# EAGLE design umodular_mega_shield_rev02 (EAGLE 7.2.0)
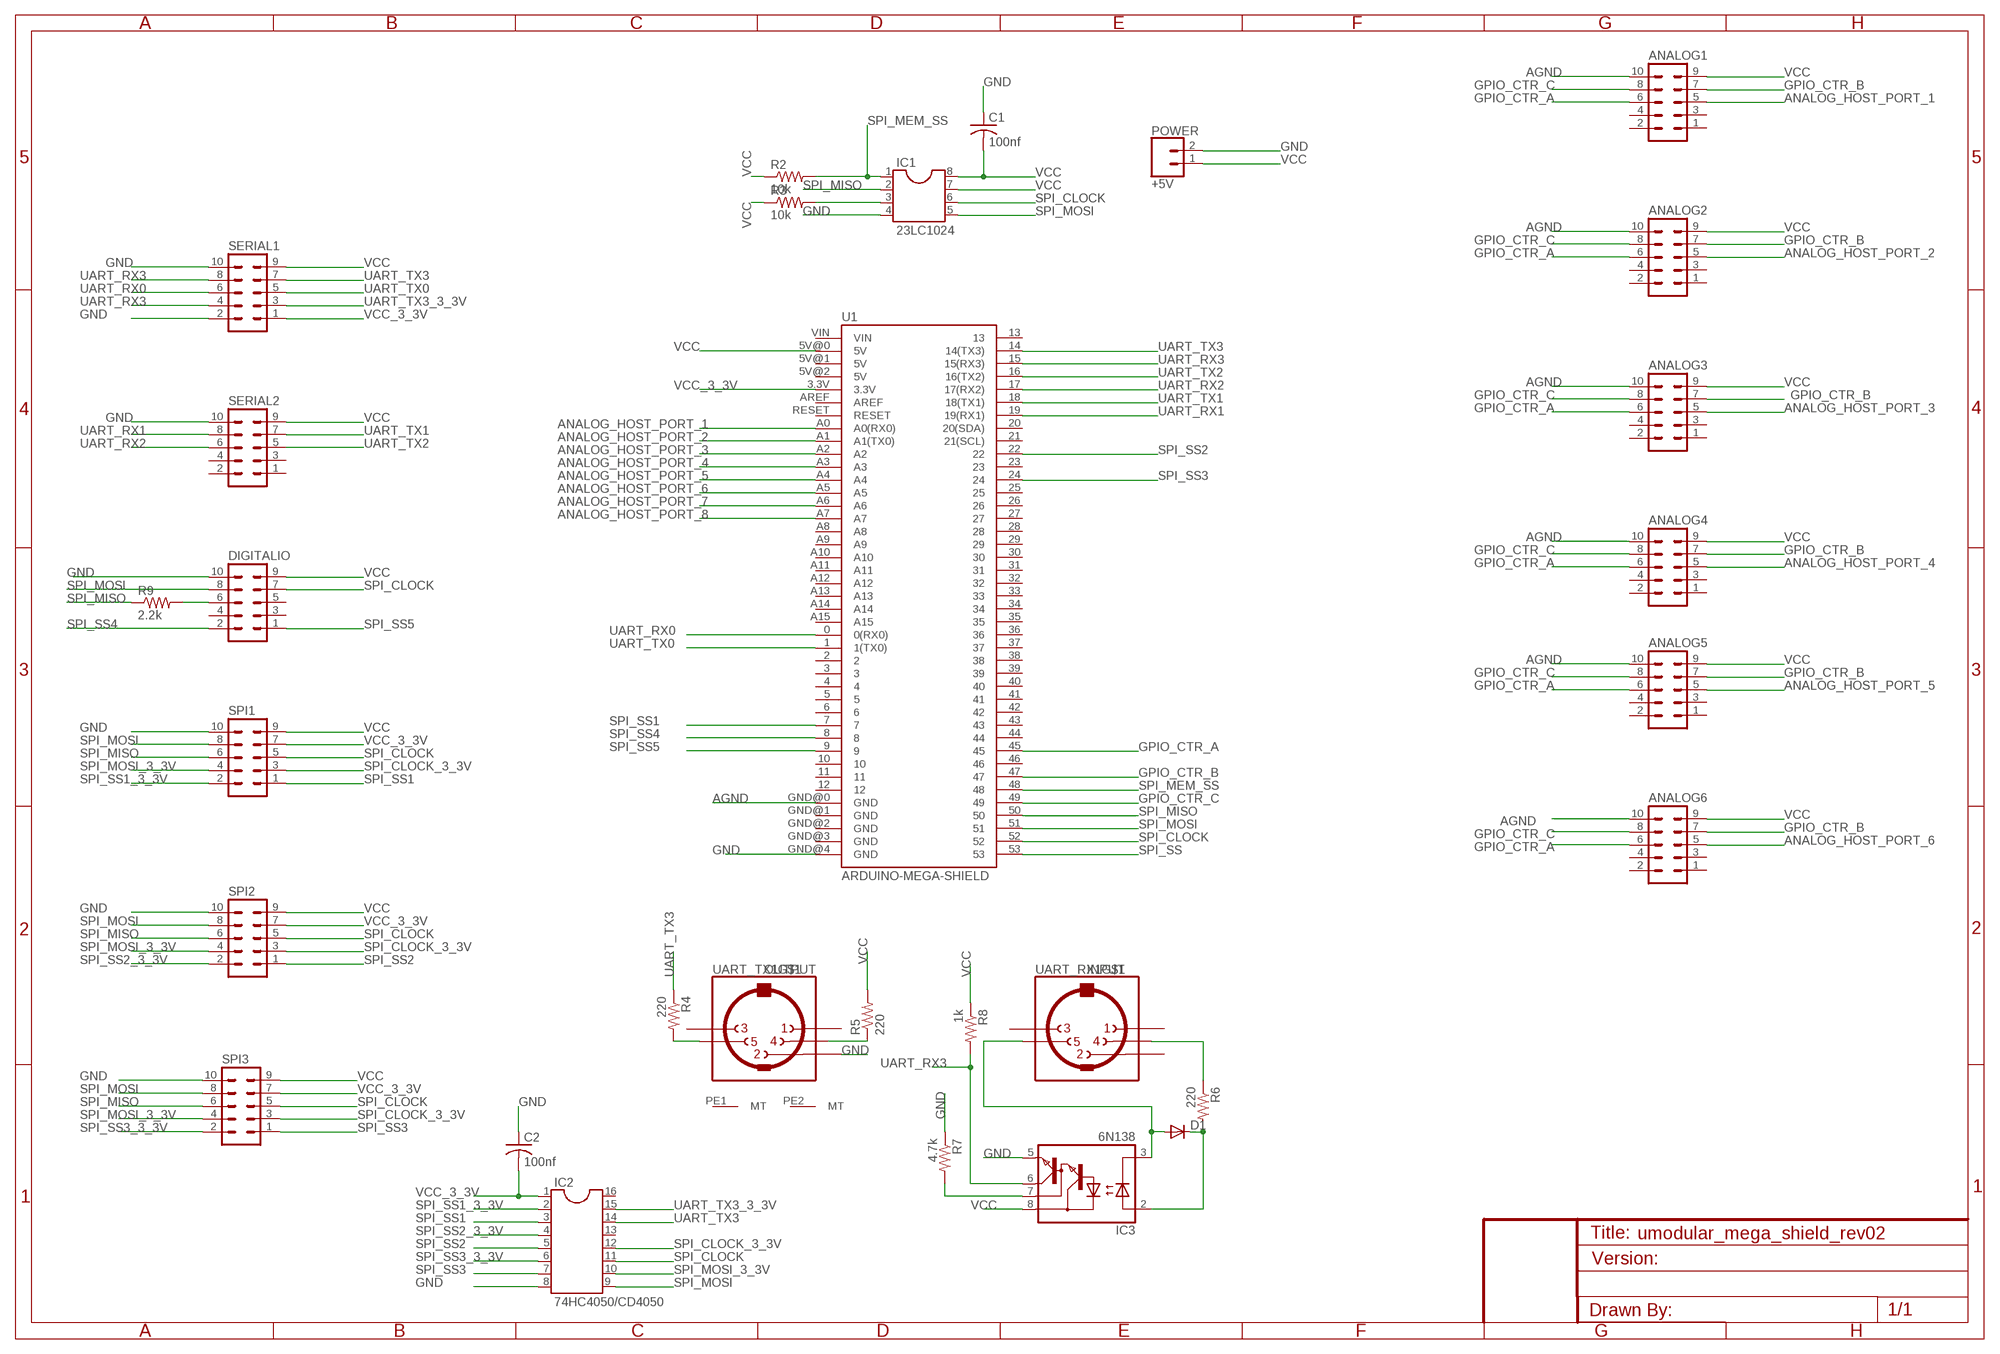
[diagram p0: schematic, sheet 1]

## Parts
ANALOG1  MA05-2  [MA05-2]
ANALOG2  MA05-2  [MA05-2]
ANALOG3  MA05-2  [MA05-2]
ANALOG4  MA05-2  [MA05-2]
ANALOG5  MA05-2  [MA05-2]
ANALOG6  MA05-2  [MA05-2]
C1  100nf  C-US050-024X044  [C050-024X044]
C2  100nf  C-US050-024X044  [C050-024X044]
D1  1N4148DO35-7  [DO35-7]
DIGITALIO  MA05-2  [MA05-2]
IC1  23LC1024  DIL8  [DIL08]
IC2  74HC4050/CD4050  DIL16  [DIL16]
IC3  6N138  [DIL08]
POWER  +5V  CONN_02LOCK_LONGPADS  [1X02_LOCK_LONGPADS]
R2  10k  R-US_0204/7  [0204/7@1]
R3  10k  R-US_0204/7  [0204/7@1]
R4  220  R-US_0204/7  [0204/7@1]
R5  220  R-US_0204/7  [0204/7@1]
R6  220  R-US_0204/7  [0204/7@1]
R7  4.7k  R-US_0204/7  [0204/7@1]
R8  1k  R-US_0204/7  [0204/7@1]
R9  2.2k  R-US_0204/7  [0204/7@1]
SERIAL1  MA05-2  [MA05-2]
SERIAL2  MA05-2  [MA05-2]
SPI1  MA05-2  [MA05-2]
SPI2  MA05-2  [MA05-2]
SPI3  MA05-2  [MA05-2]
U1  ARDUINO-MEGA-SHIELD  ARDUINO-MEGAFULL  [ARDUINO_MEGA@1]
UART_RX1  INPUT  MIDIJACK  [CP-2350]
UART_TX1  OUTPUT  MIDIJACK  [CP-2350]

## Nets
AGND: ANALOG1.10 ANALOG2.10 ANALOG3.10 ANALOG4.10 ANALOG5.10 ANALOG6.10 U1.GND@0(GND)
ANALOG_HOST_PORT_1: ANALOG1.5 U1.A0(A0(RX0))
ANALOG_HOST_PORT_2: ANALOG2.5 U1.A1(A1(TX0))
ANALOG_HOST_PORT_3: ANALOG3.5 U1.A2
ANALOG_HOST_PORT_4: ANALOG4.5 U1.A3
ANALOG_HOST_PORT_5: ANALOG5.5 U1.A4
ANALOG_HOST_PORT_6: ANALOG6.5 U1.A5
ANALOG_HOST_PORT_7: U1.A6
ANALOG_HOST_PORT_8: U1.A7
GND: C1.1 C2.1 DIGITALIO.10 IC1.4 IC2.8 IC3.5(GND) POWER.2 R7.1 SERIAL1.2 SERIAL1.10 SERIAL2.10 SPI1.10 SPI2.10 SPI3.10 U1.GND@4(GND) UART_TX1.2
GPIO_CTR_A: ANALOG1.6 ANALOG2.6 ANALOG3.6 ANALOG4.6 ANALOG5.6 ANALOG6.6 U1.45
GPIO_CTR_B: ANALOG1.7 ANALOG2.7 ANALOG3.7 ANALOG4.7 ANALOG5.7 ANALOG6.7 U1.47
GPIO_CTR_C: ANALOG1.8 ANALOG2.8 ANALOG3.8 ANALOG4.8 ANALOG5.8 ANALOG6.8 U1.49
N$2: R5.1 UART_TX1.4
N$3: R4.2 UART_TX1.5
N$4: IC1.3 R3.2
N$5: R6.1 UART_RX1.4
N$6: D1.C IC3.2(A) R6.2
N$7: D1.A IC3.3(C) UART_RX1.5
N$8: IC3.7(VB) R7.2
N$9: DIGITALIO.6 R9.2
SPI_CLOCK: DIGITALIO.7 IC1.6 IC2.11 SPI1.5 SPI2.5 SPI3.5 U1.52
SPI_CLOCK_3_3V: IC2.12 SPI1.3 SPI2.3 SPI3.3
SPI_MEM_SS: IC1.1 R2.2 U1.48
SPI_MISO: IC1.2 R9.1 SPI1.6 SPI2.6 SPI3.6 U1.50
SPI_MOSI: DIGITALIO.8 IC1.5 IC2.9 SPI1.8 SPI2.8 SPI3.8 U1.51
SPI_MOSI_3_3V: IC2.10 SPI1.4 SPI2.4 SPI3.4
SPI_SS: U1.53
SPI_SS1: IC2.3 SPI1.1 U1.7
SPI_SS1_3_3V: IC2.2 SPI1.2
SPI_SS2: IC2.5 SPI2.1 U1.22
SPI_SS2_3_3V: IC2.4 SPI2.2
SPI_SS3: IC2.7 SPI3.1 U1.24
SPI_SS3_3_3V: IC2.6 SPI3.2
SPI_SS4: DIGITALIO.2 U1.8
SPI_SS5: DIGITALIO.1 U1.9
UART_RX0: SERIAL1.6 U1.0(0(RX0))
UART_RX1: SERIAL2.8 U1.19(19(RX1))
UART_RX2: SERIAL2.6 U1.17(17(RX2))
UART_RX3: IC3.6(VO) R8.2 SERIAL1.4 SERIAL1.8 U1.15(15(RX3))
UART_TX0: SERIAL1.5 U1.1(1(TX0))
UART_TX1: SERIAL2.7 U1.18(18(TX1))
UART_TX2: SERIAL2.5 U1.16(16(TX2))
UART_TX3: IC2.14 R4.1 SERIAL1.7 U1.14(14(TX3))
UART_TX3_3_3V: IC2.15 SERIAL1.3
VCC: ANALOG1.9 ANALOG2.9 ANALOG3.9 ANALOG4.9 ANALOG5.9 ANALOG6.9 C1.2 DIGITALIO.9 IC1.7 IC1.8 IC3.8(VCC) POWER.1 R2.1 R3.1 R5.2 R8.1 SERIAL1.9 SERIAL2.9 SPI1.9 SPI2.9 SPI3.9 U1.5V@0(5V)
VCC_3_3V: C2.2 IC2.1 SERIAL1.1 SPI1.7 SPI2.7 SPI3.7 U1.3.3V
Unconnected: ANALOG1.1 ANALOG1.2 ANALOG1.3 ANALOG1.4 ANALOG2.1 ANALOG2.2 ANALOG2.3 ANALOG2.4 ANALOG3.1 ANALOG3.2 ANALOG3.3 ANALOG3.4 ANALOG4.1 ANALOG4.2 ANALOG4.3 ANALOG4.4 ANALOG5.1 ANALOG5.2 ANALOG5.3 ANALOG5.4 ANALOG6.1 ANALOG6.2 ANALOG6.3 ANALOG6.4 DIGITALIO.3 DIGITALIO.4 DIGITALIO.5 IC2.13 IC2.16 SERIAL2.1 SERIAL2.2 SERIAL2.3 SERIAL2.4 U1.2 U1.3 U1.4 U1.5 U1.5V@1(5V) U1.5V@2(5V) U1.6 U1.10 U1.11 U1.12 U1.13 U1.20(20(SDA)) U1.21(21(SCL)) U1.23 U1.25 U1.26 U1.27 U1.28 U1.29 U1.30 U1.31 U1.32 U1.33 U1.34 U1.35 U1.36 U1.37 U1.38 U1.39 U1.40 U1.41 U1.42 U1.43 U1.44 U1.46 U1.A8 U1.A9 U1.A10 U1.A11 U1.A12 U1.A13 U1.A14 U1.A15 U1.AREF U1.GND@1(GND) U1.GND@2(GND) U1.GND@3(GND) U1.RESET U1.VIN UART_RX1.1 UART_RX1.2 UART_RX1.3 UART_RX1.PE1(MT) UART_RX1.PE2(MT) UART_RX1.PE(MT) UART_RX1.PE@(MT) UART_TX1.1 UART_TX1.3 UART_TX1.PE1(MT) UART_TX1.PE2(MT) UART_TX1.PE(MT) UART_TX1.PE@(MT)

## Library data of the parts
ANALOG1-ANALOG6 DIGITALIO SERIAL1 SERIAL2 SPI1-SPI3 = con-lstb:MA05-2: PIN HEADER; OC_FARNELL: unknown; OC_NEWARK: unknown
C1 C2 = rcl:C-US: CAPACITOR, American symbol
D1 = diode:1N4148: DIODE high speed (Philips)
IC1 = ic-package:DIL8: Dual In Line / Socket
IC2 = ic-package:DIL16: Dual In Line / Socket
IC3 = optocoupler:6N138: MOTOROLA OPTO COUPLER; MF: VISHAY/TELEFUNKEN; MPN: 6N138; OC_FARNELL: 9860150; OC_NEWARK: 35K5294
POWER = SparkFun-Connectors:CONN_02: Multi connection point. Often used as Generic Header-pin footprint for 0.1 inch spaced/style header connections On any of the 0.1 inch spaced packages, you can populate with these: Break Away Headers - Straight <https://www.sparkfun.com/products/116> (PRT-00116) Break Away Male Headers - Right Angle <https://www.sparkfun.com/products/553> (PRT-00553) Female Headers <https://www.sparkfun.com/products/115> (PRT-00115) Break Away Headers - Machine Pin <https://www.sparkfun.com/products/117> (PRT-00117) Break Away Female Headers - Swiss Machine Pin <https://www.sparkfun.com/products/743> (PRT-00743) For SCREWTERMINALS and SPRING TERMINALS visit here: Screw Terimnals on SparkFun.com <https://www.sparkfun.com/search/results?term=Screw+Terminals> (5mm/3.5mm/2.54mm spacing) This device is also useful as a general connection point to wire up your design to another part of your project. Our various solder wires solder well into these plated through hole pads. Hook-Up Wire - Assortment (Stranded, 22 AWG) <https://www.sparkfun.com/products/11375> (PRT-11375) Hook-Up Wire - Assortment (Solid Core, 22 AWG) <https://www.sparkfun.com/products/11367> (PRT-11367) View the entire wire category on our website here <https://www.sparkfun.com/categories/141> Special notes: Molex polarized connector foot print use with: PRT-08233 with associated crimp pins and housings. 2.54_SCREWTERM for use with PRT-10571. 3.5mm Screw Terminal footprints for PRT-08084 5mm Screw Terminal footprints for use with PRT-08432
R2-R9 = rcl:R-US_: RESISTOR, American symbol
U1 = SparkFun-Boards:ARDUINO-MEGA: Arduino Mega board footprint
UART_RX1 UART_TX1 = adafruit:MIDIJACK: DIN 5 jack also known as MIDI jack A modification of conn-hirshman:MAB5SH with two options for the grounding 'teeth'

## Net classes
0 default: width 0.305 mm

## Board
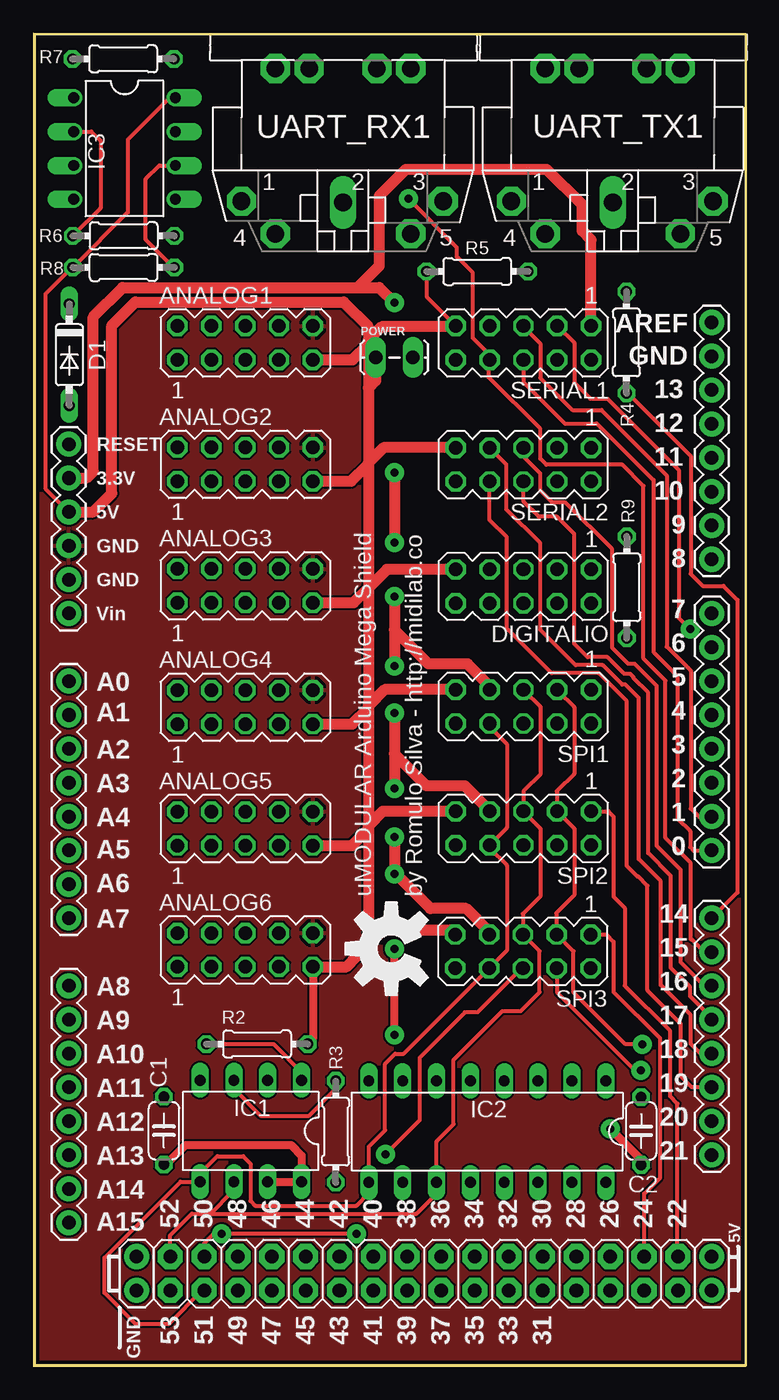
[diagram p1: board, top side]
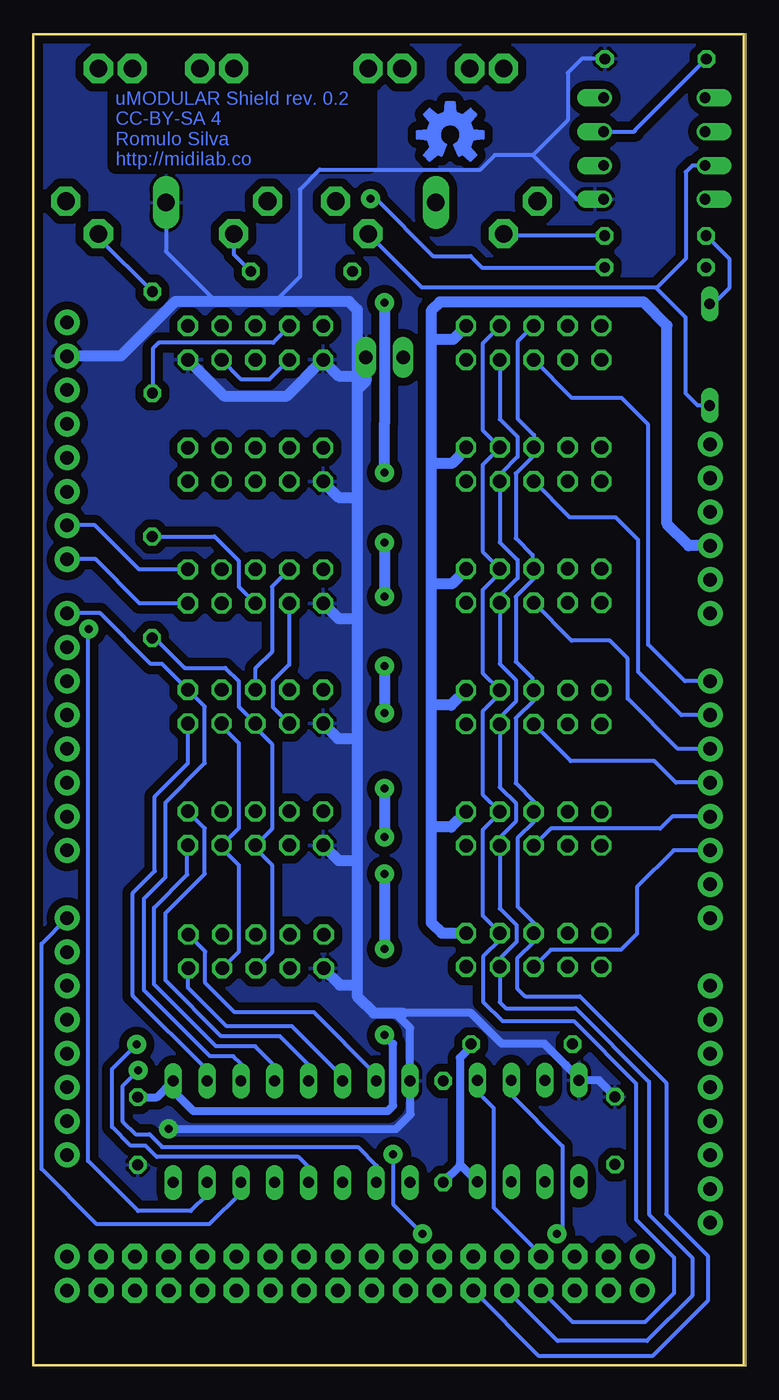
[diagram p2: board, bottom side, seen from below]

Size 53.47 x 100.02 mm. Coordinates in mm from the lower left corner, seen from the top.
Outline: 0,0 53.47,0 53.47,100 0,100.02 0,0
Copper layers (1*16): Top 0.035mm / dielectric 1.5mm / Bottom 0.035mm
Design rules "SeeedStudio_2layer_DRU_no_angle_20140221": minimum track width 6mil, minimum drill 12mil, track to track 6mil, track to pad 6mil, pad to pad 6mil, via to via 6mil, smd to smd 0mil, copper to edge 10mil, drill to drill 10mil, minimum pad ring 10mil, minimum via ring 6mil, stop-mask expansion 2mil, vias tented up to drill 100mil, thermal gap 10mil

### Footprints (pad centres in the part's own frame; a part is rotated, then mirrored left to right if it is on the bottom)
MA05-2 = drill 1.016 octagon: 1 -5.08,-1.27; 2 -5.08,1.27; 3 -2.54,-1.27; 4 -2.54,1.27; 5 0,-1.27; 6 0,1.27; 7 2.54,-1.27; 8 2.54,1.27; 9 5.08,-1.27; 10 5.08,1.27
C050-024X044 = drill 0.813 octagon: 1 -2.54,0; 2 2.54,0
DO35-7 = drill 0.813 long: A 3.81,0; C -3.81,0
DIL08 = drill 0.813 long: 1 -3.81,-3.81; 2 -1.27,-3.81; 3 1.27,-3.81; 4 3.81,-3.81; 5 3.81,3.81; 6 1.27,3.81; 7 -1.27,3.81; 8 -3.81,3.81
DIL16 = drill 0.813 long: 1 -8.89,-3.81; 2 -6.35,-3.81; 3 -3.81,-3.81; 4 -1.27,-3.81; 5 1.27,-3.81; 6 3.81,-3.81; 7 6.35,-3.81; 8 8.89,-3.81; 9 8.89,3.81; 10 6.35,3.81; 11 3.81,3.81; 12 1.27,3.81; 13 -1.27,3.81; 14 -3.81,3.81; 15 -6.35,3.81; 16 -8.89,3.81
DIL08' = drill 0.813 offset: 1 -3.81,-3.81; 2 -1.27,-3.81; 3 1.27,-3.81; 4 3.81,-3.81; 5 3.81,3.81; 6 1.27,3.81; 7 -1.27,3.81; 8 -3.81,3.81
1X02_LOCK_LONGPADS = drill 1.016 long: 1 -0.127,0; 2 2.667,0
0204/7@1 = drill 0.813 octagon: 1 -3.81,0; 2 3.81,0
ARDUINO_MEGA@1 = drill 1.016 pad 1.88: 0 61.42,50.8; 1 58.88,50.8; 2 56.34,50.8; 3 53.8,50.8; 3.3V 33.48,2.54; 4 51.26,50.8; 5 48.72,50.8; 5V@0 36.02,2.54; 5V@1 91.9,50.8; 5V@2 94.44,50.8; 6 46.18,50.8; 7 43.64,50.8; 8 39.576,50.8; 9 37.036,50.8; 10 34.496,50.8; 11 31.956,50.8; 12 29.416,50.8; 13 26.876,50.8; 14 66.5,50.8; 15 69.04,50.8; 16 71.58,50.8; 17 74.12,50.8; 18 76.66,50.8; 19 79.2,50.8; 20 81.74,50.8; 21 84.28,50.8; A0 48.72,2.54; A1 51.26,2.54; A2 53.8,2.54; A3 56.34,2.54; A4 58.88,2.54; A5 61.42,2.54; A6 63.96,2.54; A7 66.5,2.54; A8 71.58,2.54; A9 74.12,2.54; A10 76.66,2.54; A11 79.2,2.54; A12 81.74,2.54; A13 84.28,2.54; A14 86.82,2.54; A15 89.36,2.54; AREF 21.796,50.8; GND@0 38.56,2.54; GND@1 41.1,2.54; GND@2 91.9,7.62; GND@3 94.44,7.62; GND@4 24.336,50.8; RESET 30.94,2.54; VIN 43.64,2.54 | drill 1.016 pad 1.88 octagon: 22 91.9,48.26; 23 94.44,48.26; 24 91.9,45.72; 25 94.44,45.72; 26 91.9,43.18; 27 94.44,43.18; 28 91.9,40.64; 29 94.44,40.64; 30 91.9,38.1; 31 94.44,38.1; 32 91.9,35.56; 33 94.44,35.56; 34 91.9,33.02; 35 94.44,33.02; 36 91.9,30.48; 37 94.44,30.48; 38 91.9,27.94; 39 94.44,27.94; 40 91.9,25.4; 41 94.44,25.4; 42 91.9,22.86; 43 94.44,22.86; 44 91.9,20.32; 45 94.44,20.32; 46 91.9,17.78; 47 94.44,17.78; 48 91.9,15.24; 49 94.44,15.24; 50 91.9,12.7; 51 94.44,12.7; 52 91.9,10.16; 53 94.44,10.16
CP-2350 = drill 1.321 pad 2.184 octagon: 1 7.62,12.58; 3 -7.52,12.58; 4 5.08,15.02; 5 -5.08,15.02; PE -2.54,2.62; PE1 -5.08,2.62; PE2 5.08,2.62; PE@ 2.54,2.62 | drill 1.321 long: 2 0,12.68

### Placement (x,y rotation side)
ANALOG1  15.9,76.78 0 top
ANALOG2  15.9,67.67 0 top
ANALOG3  15.9,58.56 0 top
ANALOG4  15.9,49.45 0 top
ANALOG5  15.9,40.34 0 top
ANALOG6  15.9,31.23 0 top
C1  9.8,17.68 270 top
C2  45.62,17.65 90 top
D1  2.7,75.9 270 top
DIGITALIO  36.79,58.52 180 top
IC1  16.32,17.65 180 top
IC2  34.08,17.6 180 top
IC3  6N138  [DIL08']  6.85,91.38 270 top
POWER  25.83,75.7 0 top
R2  16.8,24.18 180 top
R3  22.7,17.6 90 top
R4  44.52,76.83 90 top
R5  33.33,82.15 180 top
R6  6.78,84.83 180 top
R7  6.75,98.1 180 top
R8  6.78,82.45 0 top
R9  44.55,58.45 90 top
SERIAL1  36.79,76.8 180 top
SERIAL2  36.79,67.66 180 top
SPI1  36.79,49.5 180 top
SPI2  36.79,40.36 180 top
SPI3  36.75,31.12 180 top
U1  0.12,100.12 270 top
U$1  [OSHW-LOGO-M]  22.18,92.4 0 top
U$5  [OSHW-LOGO-L]  26.88,31.32 90 top
UART_RX1  23.25,100 180 top
UART_TX1  43.5,100 180 top

### Tracks (layer width: path | path; a pad name or v marks a point on that pad's centre or on a via)
AGND
  Bottom 0.813: U1.GND@0 4.26,61.56 5.9,63.2 5.9,78.1 7.65,79.85 22.95,79.85 23.6,79.2 23.6,76.95 | 23.6,76.95 23.6,67.7 | 23.6,67.7 23.6,58.65 | 23.6,58.65 23.6,49.55 | 23.6,49.55 23.6,40.45 | 23.6,40.45 23.6,33.3 22.8,32.5 ANALOG6.10 | ANALOG1.10 20.98,78.02 21.95,77.05 23.5,77.05 23.6,76.95 | ANALOG2.10 20.98,68.81 22.05,67.75 23.55,67.75 23.6,67.7 | ANALOG3.10 20.98,59.77 22.05,58.7 23.55,58.7 23.6,58.65 | ANALOG4.10 20.98,50.72 22.1,49.6 23.55,49.6 23.6,49.55 | ANALOG5.10 20.98,41.56 22.1,40.45 23.6,40.45
  pour Top: 53.95,100.3 53.5,0.05 0.05,0.05 -0.2,100.3
ANALOG_HOST_PORT_1
  Bottom 0.305: U1.A0 4.55,51.41 7.3,54.15 7.3,70.65 9.3,72.65 13.04,72.65 ANALOG1.5
ANALOG_HOST_PORT_2
  Bottom 0.305: U1.A1 4.82,48.87 8.05,52.1 8.05,62 9.75,63.7 13.2,63.7 ANALOG2.5
ANALOG_HOST_PORT_3
  Bottom 0.305: U1.A2 5.08,46.33 8.85,50.1 8.85,53.1 10.2,54.45 13.06,54.45 ANALOG3.5
ANALOG_HOST_PORT_4
  Bottom 0.305: U1.A3 5.24,43.78 6.85,45.4 13.12,45.4 ANALOG4.5
ANALOG_HOST_PORT_5
  Bottom 0.305: U1.A4 5.5,41.24 6.4,40.35 14.63,40.35 ANALOG5.5
ANALOG_HOST_PORT_6
  Bottom 0.305: U1.A5 5.39,38.7 8.15,35.95 8.15,32.45 9.35,31.25 14.62,31.25 ANALOG6.5
GND  (via drill 0.6 pad 1.42)
  Top 0.61: C2.1 45.62,15.47 v43.3,17.8
  Bottom 0.305: IC3.5 12.66,87.56 15.97,90.88 | 35.3,79.9 33.45,81.75 33.45,88.3 32,89.75 | UART_TX1.2 43.5,83.65 39.75,79.9 | R7.1 12.3,98.1 13.35,97.05 13.35,93.5 15.97,90.88 | 32,89.75 31.95,89.8 | 15.97,90.88 18.82,90.88 19.95,89.75 32,89.75
  Bottom 0.61: C1.1 9.8,20.25 11,21.45 IC1.4 12.52,21.61 15.1,24.2 18.3,24.2 20.6,26.5 25.75,26.5 | 26.3,26.5 25.18,25.39 IC2.8 25.15,21.38 25.15,18.9 26.25,17.8 v43.3,17.8
  Bottom 0.813: 29.15,74.25 29.15,79.3 29.75,79.9 35.3,79.9 39.75,79.9 42.8,79.9 46.9,75.8 U1.GND@4 | 29.15,74.25 29.15,73.25 | 29.15,73.25 29.15,65.2 | 29.15,65.2 29.15,56.15 | 29.15,56.15 29.15,47 | 29.15,47 29.15,37.95 | 29.15,37.95 29.15,28.5 | 29.15,28.5 29.15,27.75 27.9,26.5 26.3,26.5 25.75,26.5 | 29.15,74.25 29.2,74.3 30.55,74.3 31.71,75.46 SERIAL1.10 34.44,72.8 39.15,72.8 SERIAL1.2 | SERIAL2.10 31.71,66.36 30.55,65.2 29.15,65.2 | DIGITALIO.10 31.7,57.24 30.55,56.1 29.2,56.1 29.15,56.15 | SPI1.10 31.71,48.21 30.6,47.1 29.25,47.1 29.15,47 | SPI2.10 31.69,39.09 30.55,37.95 29.15,37.95 | SPI3.10 31.67,29.82 30.45,28.6 29.25,28.6 29.15,28.5 | POWER.2 28.5,73.9 29.15,73.25
  pour Bottom (isolate 0.61): -0.15,100.3 53.95,100.3 53.5,-0.12 0,-0.12
GPIO_CTR_A
  Bottom 0.305: ANALOG1.6 15.95,78.06 17.12,76.88 17.12,71.12 15.88,69.88 15.88,68.97 ANALOG2.6 15.9,68.34 17.25,67 17.25,62.12 16,60.88 16,59.93 ANALOG3.6 15.9,59.09 17.25,57.75 17.25,52.88 16,51.62 16,50.82 ANALOG4.6 15.9,49.97 17.25,48.62 17.25,43.75 15.88,42.38 15.88,41.65 ANALOG5.6 15.9,40.84 17.12,39.62 17.12,34.5 15.88,33.25 15.88,32.53 ANALOG6.6 15.9,31.84 17.15,30.6 17.15,28.35 16.55,27.75 12.45,27.75 5.95,21.25 5.95,11.4 2.85,8.3 2.85,4.9 7,0.75 15.51,0.75 U1.45
GPIO_CTR_B
  Bottom 0.305: ANALOG1.7 18.45,71.07 17.12,69.75 17.12,68.25 18.38,67 18.38,66.47 ANALOG2.7 18.45,61.82 17.12,60.5 17.12,59.12 18.5,57.75 18.5,57.35 ANALOG3.7 18.45,52.7 17.25,51.5 17.25,49.88 18.38,48.75 18.38,48.26 ANALOG4.7 18.45,43.45 17.25,42.25 17.25,40.88 18.38,39.75 18.38,39.15 ANALOG5.7 18.45,34.32 18.42,34.32 17.2,33.1 17.2,31.85 18.45,30.6 ANALOG6.7 | ANALOG6.7 | ANALOG6.7 18.45,27.3 18,26.85 12.75,26.85 7.25,21.35 7.25,11.4 4,8.15 4,5.3 7.4,1.9 14.12,1.9 U1.47
GPIO_CTR_C
  Bottom 0.305: ANALOG1.8 19.75,76.75 19.75,70.25 ANALOG2.8 19.75,67.62 19.75,61.14 ANALOG3.8 18.45,59.55 19.75,58.25 19.75,52.03 ANALOG4.8 18.45,50.43 19.75,49.12 19.75,42.92 ANALOG5.8 18.45,41.55 19.75,40.25 19.75,33.81 ANALOG6.8 18.45,32.01 19.7,30.75 19.7,27.35 18.25,25.9 12.9,25.9 8.2,21.2 8.2,11 5.35,8.15 5.35,5.5 7.55,3.3 12.98,3.3 U1.49
N$2
  Bottom 0.305: UART_TX1.4 38.42,83.44 R5.1
N$3
  Bottom 0.305: UART_TX1.5 48.58,84.69 R4.2
N$4
  Top 0.305: IC1.3 15.05,20.8 17.05,18.8 20.7,18.8 22.7,20.8 R3.2
N$5
  Bottom 0.305: R6.1 18.02,84.83 UART_RX1.4
N$6
  Top 0.305: IC3.2 4.36,92.64 5.05,91.95 5.05,86.91 R6.2
  Bottom 0.305: D1.C 2.44,79.71 1.2,80.95 1.2,83.06 R6.2
N$7
  Bottom 0.305: D1.A 3.59,72.09 4.5,73 4.5,78.7 6.7,80.9 | 6.7,80.9 6.75,80.95 24.3,80.95 UART_RX1.5 | IC3.3 4,90.11 4.5,89.6 4.5,83.1 6.7,80.9
N$8
  Bottom 0.305: IC3.7 8.36,92.64 8.3,92.7 8.3,92.74 R7.2
N$9
  Bottom 0.305: R9.2 39.86,62.26 38.05,60.45 38.05,58.51 DIGITALIO.6
SPI_CLOCK
  Top 0.305: U1.52 10.29,9.84 11.9,11.45 13.3,11.45 | 13.3,11.45 28.75,11.45 30.25,12.95 30.25,13.78 IC2.11 30.27,16.86 31.55,18.15 31.55,23 35.2,26.65 36.6,26.65 38,28.05 38,31.14 SPI3.5 36.75,33.95 38.05,35.25 38.05,40.35 36.79,41.61 SPI2.5 36.8,43.15 38.05,44.4 38.05,49.5 SPI1.5 | 13.3,11.45 15,13.15 15,13.79 IC1.6
  Bottom 0.305: DIGITALIO.7 34.27,59.78 35.55,58.5 35.55,53.6 36.8,52.35 SPI1.5
SPI_CLOCK_3_3V  (via drill 0.6 pad 1.42)
  Top 0.305: v45.7,24.15 44.45,24.15 40.55,28.05 40.55,31.14 SPI3.3 39.25,32.44 39.25,34 40.6,35.35 40.6,40.35 SPI2.3 39.3,41.66 39.3,43.15 40.6,44.45 40.6,49.45 39.33,50.72 SPI1.3
  Bottom 0.305: v45.7,24.15 47.55,22.3 47.55,17.95 46.15,16.55 45.05,16.55 44.2,15.7 33.55,15.7 32.8,14.96 IC2.12
SPI_MEM_SS
  Top 0.305: R2.2 18.02,24.18 20.15,22.05 20.15,21.48 IC1.1
  Bottom 0.305: U1.48 15.37,8.37 18.9,11.9 18.9,19.35 20.25,20.7 20.25,21.34 IC1.1
SPI_MISO  (via drill 0.6 pad 1.42)
  Top 0.305: U1.50 12.82,9.22 13.55,9.95 v14.15,9.95 v24.25,9.95 | SPI3.6 36.66,29.86 33.35,26.55 32.4,26.55 29,23.15 29,18.45 v26.45,15.9
  Bottom 0.305: IC1.2 17.59,20.34 13.75,16.5 13.75,10.35 v14.15,9.95 | R9.1 44.34,54.64 42.1,52.4 39.05,52.4 38.05,51.4 38.05,49.49 SPI1.6 36.79,47.94 35.55,46.7 35.55,40.33 SPI2.6 36.79,38.84 35.55,37.6 35.55,31.05 SPI3.6 | v26.45,15.9 26.45,12.15 v24.25,9.95
SPI_MOSI
  Top 0.305: U1.51 12.69,5.68 10.15,3.15 7.7,3.15 5.35,5.5 5.35,8.15 11.05,13.85 IC1.5 12.52,14.46 13.8,15.75 15.75,15.75 16.3,15.2 16.3,12.4 16.65,12.05 24.25,12.05 25.2,13 25.2,13.78 IC2.9 25.18,16.48 26.4,17.7 26.4,22.7 27.15,23.45 27.8,23.45 SPI3.8 35.55,31.2 35.55,37.6 34.25,38.9 SPI2.8 35.55,40.39 35.55,46.7 34.25,48 SPI1.8
  Bottom 0.305: DIGITALIO.8 34.25,52.65 35.5,51.4 35.5,49.48 SPI1.8
SPI_MOSI_3_3V  (via drill 0.6 pad 1.42)
  Top 0.305: 39.3,29.84 SPI3.4 39.35,29.8 39.35,28 45.15,22.2 v45.6,22.2
  Bottom 0.305: SPI1.4 39.33,48.03 38.05,46.75 38.05,40.37 SPI2.4 39.33,38.88 38.05,37.6 38.05,31.09 SPI3.4 | IC2.10 27.73,14.32 27.7,14.35 27.7,15.05 29.1,16.45 43.8,16.45 44.75,17.4 45.8,17.4 46.75,18.35 46.75,21.05 v45.6,22.2
SPI_SS1
  Bottom 0.305: IC2.3 37.88,22.68 38.45,23.25 40.2,23.25 45.15,28.2 45.15,35.1 43.55,36.7 43.55,42.3 40.6,45.25 40.6,49.5 SPI1.1 43.8,52.7 44.65,52.7 48.45,56.5 50.91,56.5 U1.7
SPI_SS1_3_3V
  Bottom 0.305: IC2.2 40.42,22.23 46,27.8 46,35.5 44.35,37.15 44.35,42.75 41.85,45.25 41.85,48.21 SPI1.2
SPI_SS2
  Top 0.305: SPI2.1 43.17,41.63 43.55,41.25 43.55,35.25 44.4,34.4 44.4,28.55 47.8,25.15 47.8,20.25 48.35,19.7 48.35,8.26 U1.22
  Bottom 0.305: IC2.5 32.8,22.61 34.95,24.75 39.35,24.75 43.55,28.95 43.55,34 40.6,36.95 40.6,40.36 SPI2.1
SPI_SS2_3_3V
  Bottom 0.305: IC2.4 35.34,22.55 36.8,24 39.75,24 44.4,28.65 44.4,34.4 41.9,36.9 41.9,39.06 SPI2.2
SPI_SS3
  Top 0.305: SPI3.1 43.01,32.4 43.55,31.85 43.55,28.1 47.05,24.6 47.05,14.15 45.85,12.95 U1.24
  Bottom 0.305: IC2.7 27.73,21.88 32.4,26.55 38.35,26.55 40.55,28.75 40.55,31.11 SPI3.1
SPI_SS3_3_3V
  Bottom 0.305: IC2.6 30.27,21.71 34.05,25.5 38.95,25.5 41.85,28.4 41.85,29.84 SPI3.2
SPI_SS4
  Bottom 0.305: DIGITALIO.2 45.49,57.24 48.8,60.55 U1.8
SPI_SS5
  Bottom 0.305: DIGITALIO.1 45.53,59.78 48.85,63.1 U1.9
UART_RX0
  Top 0.305: SERIAL1.6 36.79,73.86 39.9,70.75 42.3,70.75 46.55,66.5 46.55,53.6 48.35,51.8 48.35,41.1 49.3,40.15 49.3,38.95 49.55,38.7 U1.0
UART_RX1
  Top 0.305: U1.19 49.42,20.93 48.6,21.75 48.6,25.7 46.1,28.2 46.1,36.05 45.4,36.75 45.35,36.75 44.55,37.55 44.55,49.9 42.45,52 38.9,52 35.55,55.35 35.55,62.2 34.25,63.5 SERIAL2.8
UART_RX2
  Top 0.305: U1.17 50.92,26.12 49.3,27.75 49.3,28.45 47.85,29.9 47.85,36.8 46.15,38.5 46.15,50.55 45.05,51.65 45.05,51.7 44.8,51.95 44.35,51.95 43.1,53.2 41.6,53.2 40.6,54.2 40.6,62.45 39.3,63.75 37.95,63.75 36.8,64.9 36.8,66.38 SERIAL2.6
UART_RX3  (via drill 0.6 pad 1.42)
  Top 0.305: R8.2 10.55,82.45 8.45,84.55 8.45,89.1 9.45,90.1 IC3.6 | v28.15,87.6 31.8,83.95 31.8,83.25 33,82.05 33,77.15 34.25,75.9 SERIAL1.8 34.2,75.47 34.2,74.2 38.05,70.35 38.05,68.1 38.5,67.65 44.2,67.65 45.8,66.05 45.8,53.1 47.45,51.45 47.45,39.65 49.35,37.75 49.35,32.05 49.4,32 49.45,32 50.37,31.09 U1.15
  Bottom 0.305: SERIAL1.8 34.27,75.53 35.75,74.05 37.85,74.05 SERIAL1.4 | R8.2 19.8,82.45 20.65,83.3 23.45,83.3 27.75,87.6 v28.15,87.6
UART_TX0
  Top 0.305: SERIAL1.5 36.79,78.01 38.05,76.75 38.05,74.15 40.45,71.75 42.65,71.75 47.55,66.85 47.55,54 49.35,52.2 49.35,41.85 50,41.2 50.88,41.2 U1.1
UART_TX1
  Top 0.305: U1.18 50.09,23.46 49.35,24.2 49.35,26.35 47.1,28.6 47.1,36.4 45.45,38.05 45.45,50.15 44.45,51.15 44.2,51.15 42.75,52.6 40.7,52.6 38.05,55.25 38.05,61.75 35.5,64.3 35.5,67.67 SERIAL2.7
UART_TX2
  Top 0.305: U1.16 50.35,28.55 48.6,30.3 48.6,37.25 46.8,39.05 46.8,51.05 45.15,52.7 44.65,52.7 43.45,53.9 43.45,61.3 39.95,64.8 38.95,64.8 38.05,65.7 38.05,67 36.85,68.2 36.85,68.86 SERIAL2.5
UART_TX3
  Top 0.305: R4.1 44.63,73.02 49.35,68.3 49.35,59.45 50.25,58.55 51.8,58.55 52.85,57.5 52.85,35.55 U1.14
  Bottom 0.305: SERIAL1.7 34.25,78 35.45,76.8 44.05,76.8 44.5,76.35 44.5,73.04 R4.1 | IC2.14 37.88,13.02 40.25,10.65 48.7,10.65 52.85,14.8 52.85,31.7 U1.14
UART_TX3_3_3V  (via drill 0.6 pad 1.42)
  Top 0.305: SERIAL1.3 40.6,76.8 40.6,73.8 41.8,72.6 43.1,72.6 48.45,67.25 48.45,56.15 48.8,55.8 v49.3,55.3
  Bottom 0.305: IC2.15 40.42,12.88 41.65,11.65 45.6,11.65 49.35,15.4 49.35,55.25 v49.3,55.3
VCC
  Top 0.305: U1.5V@0 0.9,65.87 0.9,80.45 2.9,82.45 R8.1 7.1,86.58 7.1,92.05 10.23,95.19 IC3.8 | R5.2 29.52,80.26 SERIAL1.9
  Top 0.61: C1.2 9.98,15.13 11.45,16.6 19.35,16.6 20.15,15.8 20.15,13.86 IC1.8 IC1.7 | ANALOG6.9 20.98,24.55 R2.1
  Top 0.813: U1.5V@0 4.5,64.11 5.9,65.5 5.9,78.1 7.65,79.85 23.3,79.85 25.15,78 25.15,77 | 25.15,77 25.15,76.7 | 25.15,76.7 25.15,73.4 | 25.15,73.4 25.15,67.8 | 25.15,67.8 25.15,67.7 | 25.15,67.7 25.15,58.4 | 25.15,58.4 25.15,49.55 | 25.15,49.55 25.15,49.4 | 25.15,49.4 25.15,40.55 | 25.15,40.55 25.15,40.3 | 25.15,40.3 25.15,31.6 | 25.15,31.6 25.1,31.6 23.52,29.96 ANALOG6.9 | ANALOG1.9 23.96,75.52 25.15,76.7 | ANALOG2.9 23.86,66.41 25.15,67.7 | ANALOG3.9 24.05,57.3 25.15,58.4 | ANALOG4.9 23.93,48.19 25.15,49.4 | ANALOG5.9 23.93,39.08 25.15,40.3 | SERIAL1.9 31.64,78 26.15,78 25.15,77 | SERIAL2.9 26.27,68.92 25.15,67.8 | DIGITALIO.9 26.54,59.78 25.15,58.4 | SPI1.9 26.37,50.77 25.15,49.55 | SPI2.9 26.23,41.63 25.15,40.55 | 25.15,31.6 26.3,32.75 31.32,32.75 SPI3.9 | POWER.1 25.7,73.95 25.15,73.4
  Bottom 0.61: R2.1 20.61,23.99 21.45,23.15 21.45,15.15 | 21.45,15.15 IC1.8 | 21.45,15.15 21.45,15.04 R3.1
VCC_3_3V  (via drill 0.6 pad 1.42)
  Top 0.61: v27.1,24.85 v27.1,31.3
  Top 0.813: U1.3.3V 4,66.64 4.5,67.15 4.5,78.75 6.7,80.95 24.35,80.95 | 24.35,80.95 25.95,80.95 v27.1,79.8 | v27.1,67.05 v27.1,61.8 | v27.1,57.75 27.1,55.25 | 27.1,55.25 v27.1,52.55 | v27.1,49 27.1,45.95 | 27.1,45.95 v27.1,43.35 | v27.1,39.7 27.1,37.05 | 27.1,37.05 v27.1,36.95 | SPI1.7 34.25,51.05 32.6,52.7 29.65,52.7 27.1,55.25 | SPI2.7 34.25,41.7 32.4,43.55 29.5,43.55 27.1,45.95 | SPI3.7 34.21,32.64 32.5,34.35 29.8,34.35 27.1,37.05 | SERIAL1.1 41.87,84.53 41.2,85.2 41.2,87.15 38.55,89.8 27.95,89.8 25.95,87.8 25.95,82.55 24.35,80.95
  Bottom 0.61: C2.2 44.19,20.19 IC2.1 42.97,20.66 41.45,19.15 26.85,19.15 26.45,19.55 26.45,24.2 v27.1,24.85
  Bottom 0.813: v27.1,61.8 v27.1,57.75 | v27.1,52.55 v27.1,49 | v27.1,43.35 v27.1,39.7 | v27.1,36.95 v27.1,31.3 | v27.1,79.8 27.1,70.95 27.1,70.8 v27.1,67.05

### Text on the board
Bottom: uMODULAR Shield rev. 0.2 / CC-BY-SA 4 / Romulo Silva / http://midilab.co
tNames: uMODULAR Arduino Mega Shield / / by Romulo Silva - http://midilab.co